# EAGLE schematic PNP - Tray Base (EAGLE 9.6.2)
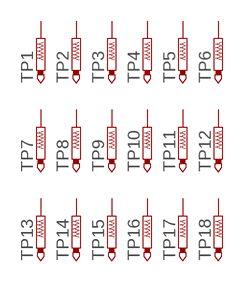
[diagram p0: schematic, sheet 1]

## Parts
TP1  PTR1B2,54  [B2,54]
TP2  PTR1B2,54  [B2,54]
TP3  PTR1B2,54  [B2,54]
TP4  PTR1B2,54  [B2,54]
TP5  PTR1B2,54  [B2,54]
TP6  PTR1B2,54  [B2,54]
TP7  PTR1B2,54  [B2,54]
TP8  PTR1B2,54  [B2,54]
TP9  PTR1B2,54  [B2,54]
TP10  PTR1B2,54  [B2,54]
TP11  PTR1B2,54  [B2,54]
TP12  PTR1B2,54  [B2,54]
TP13  PTR1B2,54  [B2,54]
TP14  PTR1B2,54  [B2,54]
TP15  PTR1B2,54  [B2,54]
TP16  PTR1B2,54  [B2,54]
TP17  PTR1B2,54  [B2,54]
TP18  PTR1B2,54  [B2,54]
Unconnected: TP1.TP TP2.TP TP3.TP TP4.TP TP5.TP TP6.TP TP7.TP TP8.TP TP9.TP TP10.TP TP11.TP TP12.TP TP13.TP TP14.TP TP15.TP TP16.TP TP17.TP TP18.TP

## Library data of the parts
TP1-TP18 = testpad:PTR1: TEST PIN